# Altium project VCA.PrjPCB
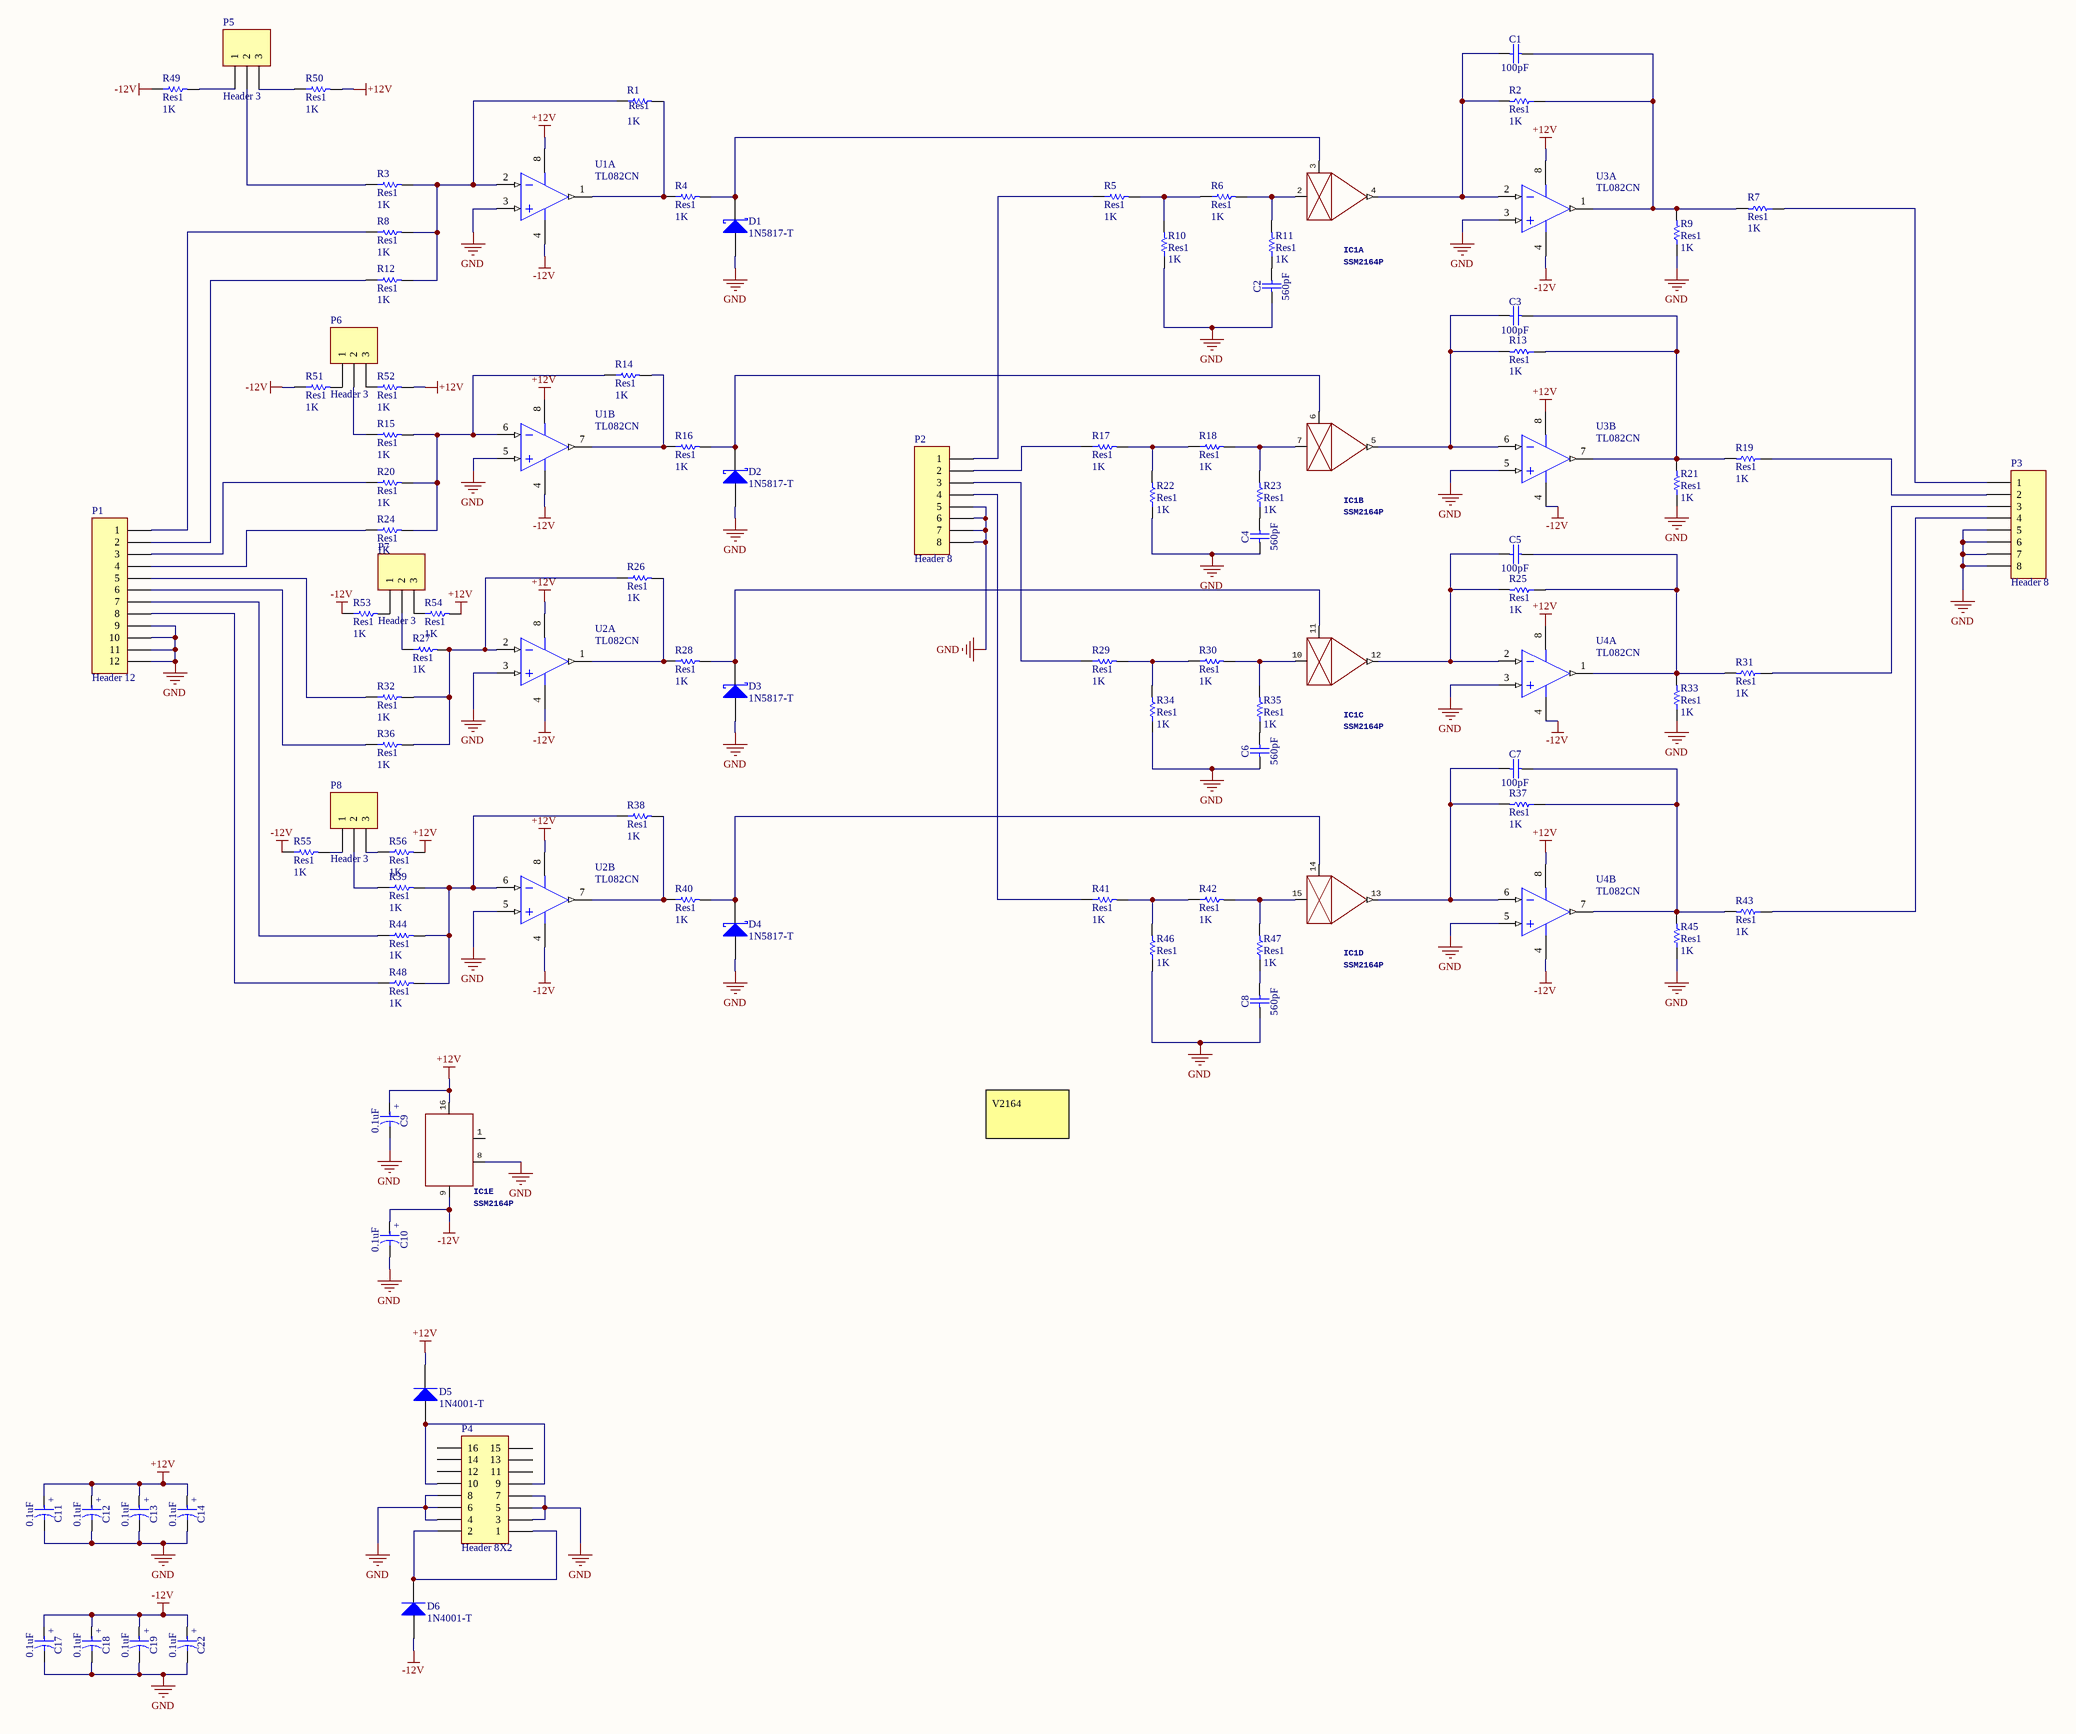
[diagram p0: VCA.SchDoc]
1 sheet, 93 parts. Net scope: global (net labels, ports and power ports of the same name join across sheets).

## Sheet VCA.SchDoc
size A2

### Parts
C1  100pF  [CAPRR508-254X381X584]
C2  560pF  [CAPRR254-254X381X381]
C3  100pF  [CAPRR508-254X381X584]
C4  560pF  [CAPRR254-254X381X381]
C5  100pF  [CAPRR508-254X381X584]
C6  560pF  [CAPRR254-254X381X381]
C7  100pF  [CAPRR508-254X381X584]
C8  560pF  [CAPRR254-254X381X381]
C9  0.1uF  [CAPPRB508-450x850]
C10  0.1uF  [CAPPRB508-450x850]
C11  0.1uF  [CAPPRB508-450x850]
C12  0.1uF  [CAPPRB508-450x850]
C13  0.1uF  [CAPPRB508-450x850]
C14  0.1uF  [CAPPRB508-450x850]
C17  0.1uF  [CAPPRB508-450x850]
C18  0.1uF  [CAPPRB508-450x850]
C19  0.1uF  [CAPPRB508-450x850]
C22  0.1uF  [CAPPRB508-450x850]
D1  1N5817-T  [DIOD-DO-41-P-2]
D2  1N5817-T  [DIOD-DO-41-P-2]
D3  1N5817-T  [DIOD-DO-41-P-2]
D4  1N5817-T  [DIOD-DO-41-P-2]
D5  1N4001-T  [DIOD-DO-41-P-2_V]
D6  1N4001-T  [DIOD-DO-41-P-2_V]
IC1  SSM2164P  [DIL16]  (parts A,B,C,D,E of 5)
P1  Header 12  [HDR1X12]
P2  Header 8  [HDR1X8]
P3  Header 8  [HDR1X8]
P4  Header 8X2  [HDR2X8]
P5  Header 3  [HDR1X3]
P6  Header 3  [HDR1X3]
P7  Header 3  [HDR1X3]
P8  Header 3  [HDR1X3]
R1  Res1  value 1K  [AXIAL-0.3]
R2  Res1  value 1K  [AXIAL-0.3]
R3  Res1  value 1K  [AXIAL-0.3]
R4  Res1  value 1K  [AXIAL-0.3]
R5  Res1  value 1K  [AXIAL-0.3]
R6  Res1  value 1K  [AXIAL-0.3]
R7  Res1  value 1K  [AXIAL-0.3]
R8  Res1  value 1K  [AXIAL-0.3]
R9  Res1  value 1K  [AXIAL-0.3]
R10  Res1  value 1K  [AXIAL-0.3]
R11  Res1  value 1K  [AXIAL-0.3]
R12  Res1  value 1K  [AXIAL-0.3]
R13  Res1  value 1K  [AXIAL-0.3]
R14  Res1  value 1K  [AXIAL-0.3]
R15  Res1  value 1K  [AXIAL-0.3]
R16  Res1  value 1K  [AXIAL-0.3]
R17  Res1  value 1K  [AXIAL-0.3]
R18  Res1  value 1K  [AXIAL-0.3]
R19  Res1  value 1K  [AXIAL-0.3]
R20  Res1  value 1K  [AXIAL-0.3]
R21  Res1  value 1K  [AXIAL-0.3]
R22  Res1  value 1K  [AXIAL-0.3]
R23  Res1  value 1K  [AXIAL-0.3]
R24  Res1  value 1K  [AXIAL-0.3]
R25  Res1  value 1K  [AXIAL-0.3]
R26  Res1  value 1K  [AXIAL-0.3]
R27  Res1  value 1K  [AXIAL-0.3]
R28  Res1  value 1K  [AXIAL-0.3]
R29  Res1  value 1K  [AXIAL-0.3]
R30  Res1  value 1K  [AXIAL-0.3]
R31  Res1  value 1K  [AXIAL-0.3]
R32  Res1  value 1K  [AXIAL-0.3]
R33  Res1  value 1K  [AXIAL-0.3]
R34  Res1  value 1K  [AXIAL-0.3]
R35  Res1  value 1K  [AXIAL-0.3]
R36  Res1  value 1K  [AXIAL-0.3]
R37  Res1  value 1K  [AXIAL-0.3]
R38  Res1  value 1K  [AXIAL-0.3]
R39  Res1  value 1K  [AXIAL-0.3]
R40  Res1  value 1K  [AXIAL-0.3]
R41  Res1  value 1K  [AXIAL-0.3]
R42  Res1  value 1K  [AXIAL-0.3]
R43  Res1  value 1K  [AXIAL-0.3]
R44  Res1  value 1K  [AXIAL-0.3]
R45  Res1  value 1K  [AXIAL-0.3]
R46  Res1  value 1K  [AXIAL-0.3]
R47  Res1  value 1K  [AXIAL-0.3]
R48  Res1  value 1K  [AXIAL-0.3]
R49  Res1  value 1K  [AXIAL-0.3]
R50  Res1  value 1K  [AXIAL-0.3]
R51  Res1  value 1K  [AXIAL-0.3]
R52  Res1  value 1K  [AXIAL-0.3]
R53  Res1  value 1K  [AXIAL-0.3]
R54  Res1  value 1K  [AXIAL-0.3]
R55  Res1  value 1K  [AXIAL-0.3]
R56  Res1  value 1K  [AXIAL-0.3]
U1  TL082CN  [STM-N8]  (parts A,B of 2)
U2  TL082CN  [STM-N8]  (parts A,B of 2)
U3  TL082CN  [STM-N8]  (parts A,B of 2)
U4  TL082CN  [STM-N8]  (parts A,B of 2)

### Nets
+12V: C9.1 C11.1 C12.1 C13.1 C14.1 D5.2(K) IC1.16(V+) R50.2 R52.2 R54.2 R56.2 U1.8(VCC+) U2.8(VCC+) U3.8(VCC+) U4.8(VCC+)
-12V: C10.1 C17.1 C18.1 C19.1 C22.1 D6.1(A) IC1.9(V-) R49.1 R51.1 R53.1 R55.1 U1.4(VCC-) U2.4(VCC-) U3.4(VCC-) U4.4(VCC-)
GND: C2.1 C4.1 C6.1 C8.1 C9.2 C10.2 C11.2 C12.2 C13.2 C14.2 C17.2 C18.2 C19.2 C22.2 D1.1(A) D2.1(A) D3.1(A) D4.1(A) IC1.8(GND) P1.9 P1.10 P1.11 P1.12 P2.5 P2.6 P2.7 P2.8 P3.5 P3.6 P3.7 P3.8 P4.3 P4.4 P4.5 P4.6 P4.7 P4.8 R9.1 R10.1 R21.1 R22.1 R33.1 R34.1 R45.1 R46.1 U1.3(IN1+) U1.5(IN2+) U2.3(IN1+) U2.5(IN2+) U3.3(IN1+) U3.5(IN2+) U4.3(IN1+) U4.5(IN2+)
NetC1_1: C1.1 IC1.4(OUT) R2.2 U3.2(IN1-)
NetC1_2: C1.2 R2.1 R7.2 R9.2 U3.1(OUT1)
NetC2_2: C2.2 R11.1
NetC3_1: C3.1 IC1.5(OUT) R13.2 U3.6(IN2-)
NetC3_2: C3.2 R13.1 R19.2 R21.2 U3.7(OUT2)
NetC4_2: C4.2 R23.1
NetC5_1: C5.1 IC1.12(OUT) R25.2 U4.2(IN1-)
NetC5_2: C5.2 R25.1 R31.2 R33.2 U4.1(OUT1)
NetC6_2: C6.2 R35.1
NetC7_1: C7.1 IC1.13(OUT) R37.2 U4.6(IN2-)
NetC7_2: C7.2 R37.1 R43.2 R45.2 U4.7(OUT2)
NetC8_2: C8.2 R47.1
NetD1_2: D1.2(K) IC1.3(CTRL) R4.2
NetD2_2: D2.2(K) IC1.6(CTRL) R16.2
NetD3_2: D3.2(K) IC1.11(CTRL) R28.2
NetD4_2: D4.2(K) IC1.14(CTRL) R40.2
NetD5_1: D5.1(A) P4.9 P4.10
NetD6_2: D6.2(K) P4.1 P4.2
NetIC1_2: IC1.2(IN) R6.2 R11.2
NetIC1_7: IC1.7(IN) R18.2 R23.2
NetIC1_10: IC1.10(IN) R30.2 R35.2
NetIC1_15: IC1.15(IN) R42.2 R47.2
NetP1_1: P1.1 R8.1
NetP1_2: P1.2 R12.1
NetP1_3: P1.3 R20.1
NetP1_4: P1.4 R24.1
NetP1_5: P1.5 R32.1
NetP1_6: P1.6 R36.1
NetP1_7: P1.7 R44.1
NetP1_8: P1.8 R48.1
NetP2_1: P2.1 R5.1
NetP2_2: P2.2 R17.1
NetP2_3: P2.3 R29.1
NetP2_4: P2.4 R41.1
NetP3_1: P3.1 R7.1
NetP3_2: P3.2 R19.1
NetP3_3: P3.3 R31.1
NetP3_4: P3.4 R43.1
NetP5_1: P5.1 R49.2
NetP5_2: P5.2 R3.1
NetP5_3: P5.3 R50.1
NetP6_1: P6.1 R51.2
NetP6_2: P6.2 R15.1
NetP6_3: P6.3 R52.1
NetP7_1: P7.1 R53.2
NetP7_2: P7.2 R27.1
NetP7_3: P7.3 R54.1
NetP8_1: P8.1 R55.2
NetP8_2: P8.2 R39.1
NetP8_3: P8.3 R56.1
NetR1_1: R1.1 R3.2 R8.2 R12.2 U1.2(IN1-)
NetR1_2: R1.2 R4.1 U1.1(OUT1)
NetR5_2: R5.2 R6.1 R10.2
NetR14_1: R14.1 R15.2 R20.2 R24.2 U1.6(IN2-)
NetR14_2: R14.2 R16.1 U1.7(OUT2)
NetR17_2: R17.2 R18.1 R22.2
NetR26_1: R26.1 R27.2 R32.2 R36.2 U2.2(IN1-)
NetR26_2: R26.2 R28.1 U2.1(OUT1)
NetR29_2: R29.2 R30.1 R34.2
NetR38_1: R38.1 R39.2 R44.2 R48.2 U2.6(IN2-)
NetR38_2: R38.2 R40.1 U2.7(OUT2)
NetR41_2: R41.2 R42.1 R46.2

Not connected (* = marked no-connect by the designer): IC1 1(MODE); P4 11 12 13 14 15 16

### Notes on the sheet
- V2164
- Title
- Size:
- Date:
- File:
- A2
- Number:
- Time:
- Revision:
- Sheet
- of
- (in symbol CTEB_0.1UF_35V_10%_508-450X850) +

### Library data of the parts
C1 C3 C5 C7 = CCR_100PF_100V_5%_C0G_508-254X381X584: Non-polarised capacitor; Part Description: Radial Lead Type Multilayer Ceramic Capacitor; Manufacturer: GENERIC; Manufacturer1 Part Number: C317C101J1G5TA; Voltage: 100VDC; TC: C0G; Tolerance: ±5%; Part Number: CCR_100PF_100V_5%_C0G_508-254X381X584; Component Kind: Standard; Component Type: Standard; Pin Count: 2; Value: 100pF; Status: None; Manufacturer Part Number: CCR_100PF_100V_5%_C0G_508-254X381X584; Case: LS5.08 W2.54 x L3.81 x H5.84; Mounted: Yes; Socket: No; SMD: No; Sense: No; ComponentHeight: 5.84mm; Manufacturer1 Example: KEMET; Manufacturer1 ComponentHeight: 5.84mm; HelpURL: \\cern.ch\dfs\Applications\Altium\Datasheets\CCR_KEMET_C317.pdf; Author: CERN DEM JLC; CreateDate: 17/12/2008; LatestRevisionDate: 16/04/2015
C2 C4 C6 C8 = CCR_560PF_100V_5%_C0G_254-254X381X381: Non-polarised capacitor; Part Description: Radial Lead Type Multilayer Ceramic Capacitor; Manufacturer: AVX; Manufacturer Part Number: SR151A561JAA; Voltage: 100VDC; TC: C0G; Tolerance: ±5%; Part Number: CCR_560PF_100V_5%_C0G_254-254X381X381; Component Kind: Standard; Component Type: Standard; Pin Count: 2; Value: 560pF; Status: None; Case: LS2.54 W2.54 x L3.81 x H3.81; Mounted: Yes; Socket: No; SMD: No; Sense: No; ComponentHeight: 3.81mm; HelpURL: \\cern.ch\dfs\Applications\Altium\Datasheets\CCR_AVX_SR15.pdf; Author: CERN DEM JLC; CreateDate: 17/11/2010; LatestRevisionDate: 16/04/2015
C9-C14 C17-C19 C22 = CTEB_0.1UF_35V_10%_508-450X850: Polarised capacitor; Part Description: Solid Tantalum Resin Dipped Capacitor; Manufacturer: AVX; Manufacturer Part Number: TAP104M035CCS-LF; Voltage: 35V; Tolerance: ±10%; Part Number: CTEB_0.1UF_35V_10%_508-450X850; Component Kind: Standard; Component Type: Standard; Pin Count: 2; Value: 0.1uF; Status: None; Case: LS5.08 D4.5 x H8.5; Mounted: Yes; Socket: No; SMD: No; Sense: No; ComponentHeight: 8.5mm; HelpURL: \\cern.ch\dfs\Applications\Altium\Datasheets\CTEB_AVX_TAP.pdf; Author: CERN DEM JLC; CreateDate: 19/08/2010; LatestRevisionDate: 19/08/2010
D1-D4 = CMP-2000-05521-1: Schottky Barrier Rectifier, 1 A, 20 V, -65 to 125 degC, 2-Pin DO-41, RoHS, Tape and Reel; Manufacturer: DiodesIncorporated; Vrrm - Repetitive Reverse Voltage: 20V; If - Forward Current: 1A; Configuration: Single; Unit Weight: 0.010582oz; Type: SchottkyDiode; Ifsm - Forward Surge Current: 25A; Vf - Forward Voltage: 0.75Vat3A; Ir - Reverse Current: 1000uA; Technology: Si; Length: 5.21mm; Product: SchottkyRectifiers; Package Reference: DO-41-P-2; Package / Case: DO-41; Datasheet URL: http://www.diodes.com/_files/datasheets/ds23001.pdf; Operating Temperature Range: -65Cto+125C; Mounting Style: ThroughHole; Manufacturer URL: http://www.diodes.com/; Series: 1N58; Minimum Operating Temperature: -65C; Height: 2.72mm; Brand: DiodesIncorporated; Maximum Operating Temperature: +125C; Datasheet Version: Rev. 8-2, 05/2009; Factory Pack Quantity: 5000; Width: 2.72mm; RoHS: True; Product Category: SchottkyDiodes&Rectifiers; Package Description: 2-Pin Through Hole Device, Body 4.635 x 2.36 mm, Pin Spacing 7.85 mm; Packaging: Reel; Termination Style: ThroughHole; Mounting Technology: ThroughHole
D5 D6 = CMP-0639-00006-1: 1.0 A Rectifier, 15 pF, 50 V, -65 to 150 degC, 2-Pin DO-41 Plastic, RoHS, Tape and Reel; Manufacturer: Diodes Inc; Max. IR (uA): 5; CT (pF): 15; Max. Average Rectified Current IO (A): 1; VRRM (V): 50; Max. IFSM (A): 30; PartNumber: 1N4001-T; PackageReference: DO-41-P-2; RoHS: TRUE; Operating Temperature Range (degC): -65 to 150; Mounting Technology: Through Hole; VF (V): 1; PackageDescription: 2-Pin Axial Lead, Body 4.635 x 2.36 mm, Lead Spread 25.4 mm; ComponentLink2URL: http://diodes.com/datasheets/ds28002.pdf; Packing: Tape and Reel; DatasheetVersion: Rev. 8-2; ComponentLink2Description: Datasheet; ComponentLink1Description: Manufacturer URL; ComponentLink1URL: http://diodes.com/
IC1 = SSM2164P: GateName_1: A; SymbolName_1: GAINCELL; GateName_2: B; GateName_3: C; GateName_4: D; GateName_5: E; SymbolName_5: VCCBLK; DeviceName: P; SymbolName_2: GAINCELL; SymbolName_3: GAINCELL; SymbolName_4: GAINCELL; LibraryName: ssm2164_2; DeviceSetName: SSM2164; Package: DIL16
P1 = Header 12: Header, 12-Pin; LatestRevisionDate: 17-Jul-2002; LatestRevisionNote: Re-released for DXP Platform.; Publisher: Altium Limited
P2 P3 = Header 8: Header, 8-Pin; LatestRevisionDate: 17-Jul-2002; LatestRevisionNote: Re-released for DXP Platform.; Publisher: Altium Limited
P4 = Header 8X2: Header, 8-Pin, Dual row; LatestRevisionDate: 17-Jul-2002; LatestRevisionNote: Re-released for DXP Platform.; Publisher: Altium Limited
P5-P8 = Header 3: Header, 3-Pin; LatestRevisionDate: 17-Jul-2002; LatestRevisionNote: Re-released for DXP Platform.; Publisher: Altium Limited
R1-R56 = Res1: Resistor; Published: 8-Jun-2000; LatestRevisionDate: 17-Jul-2002; LatestRevisionNote: Re-released for DXP Platform.; PackageReference: AXIAL-0.3; Publisher: Altium Limited; PackageDescription: Axial Device, Thru-Hole; 2 Leads; 0.3 in Pin Spacing
U1-U4 = CMP-2000-07247-1: General Purpose JFET Dual Operational Amplifier, 4 MHz, 6 to 36 V, 0 to 70 degC, 8-Pin DIP (N8), RoHS, Tube; Manufacturer: STMicroelectronics; Manufacturer Type: GeneralPurposeAmplifier; Number of Channels per Chip: 2; Typical Dual Supply Voltage: 5V; Maximum Input Offset Voltage: 10mV@15V; Typical Slew Rate: 16V/us@15V; Rail to Rail: No; Maximum Dual Supply Voltage: 18V; Minimum CMRR: 70dB; Maximum Supply Current: 2.5mA@15V; Typical Input Noise Voltage Density: 15nV/rtHz@15V; Pin_Count: 8; Minimum Dual Supply Voltage: 3V; Maximum Power Dissipation: 680mW; Product Height: 3.3mm; Typical Voltage Gain: 106.02dB; Typical Gain Bandwidth Product: 4MHz; Maximum Input Bias Current: 0.0004uA@15V; Product Length: 9.27mm; Product Width: 6.35mm; Power Supply Type: Dual; Package Description: 8-Pin Double In-line Package, Body 9.59 x 6.605 mm, Pitch 2.54 mm; Datasheet Version: Rev. 10, 06/2008; Shut Down Support: No; Package Reference: N8; Mounting Technology: ThroughHole; Maximum Operating Temperature: 70C; Type: GeneralPurposeAmplifier; Manufacturer URL: http://www.st.com/; Mounting: ThroughHole; Minimum Operating Temperature: 0C; Supplier_Package: PDIP; Family: TL082; Technology: BiFET; Product Type: OPAmp; Packaging: Tube; Datasheet URL: https://datasheet.ciiva.com/19471/2002077-19471009.pdf; PartId: 1